# EasyEDA schematic SCH_Atmega328-Dev_Board v0.1_2022-11-11.json
TITLE: Sheet_1; REV: 1.0; Date: 2022-08-23; Sheet: 1/1; Drawn By: Max Solo; Company: Your Company
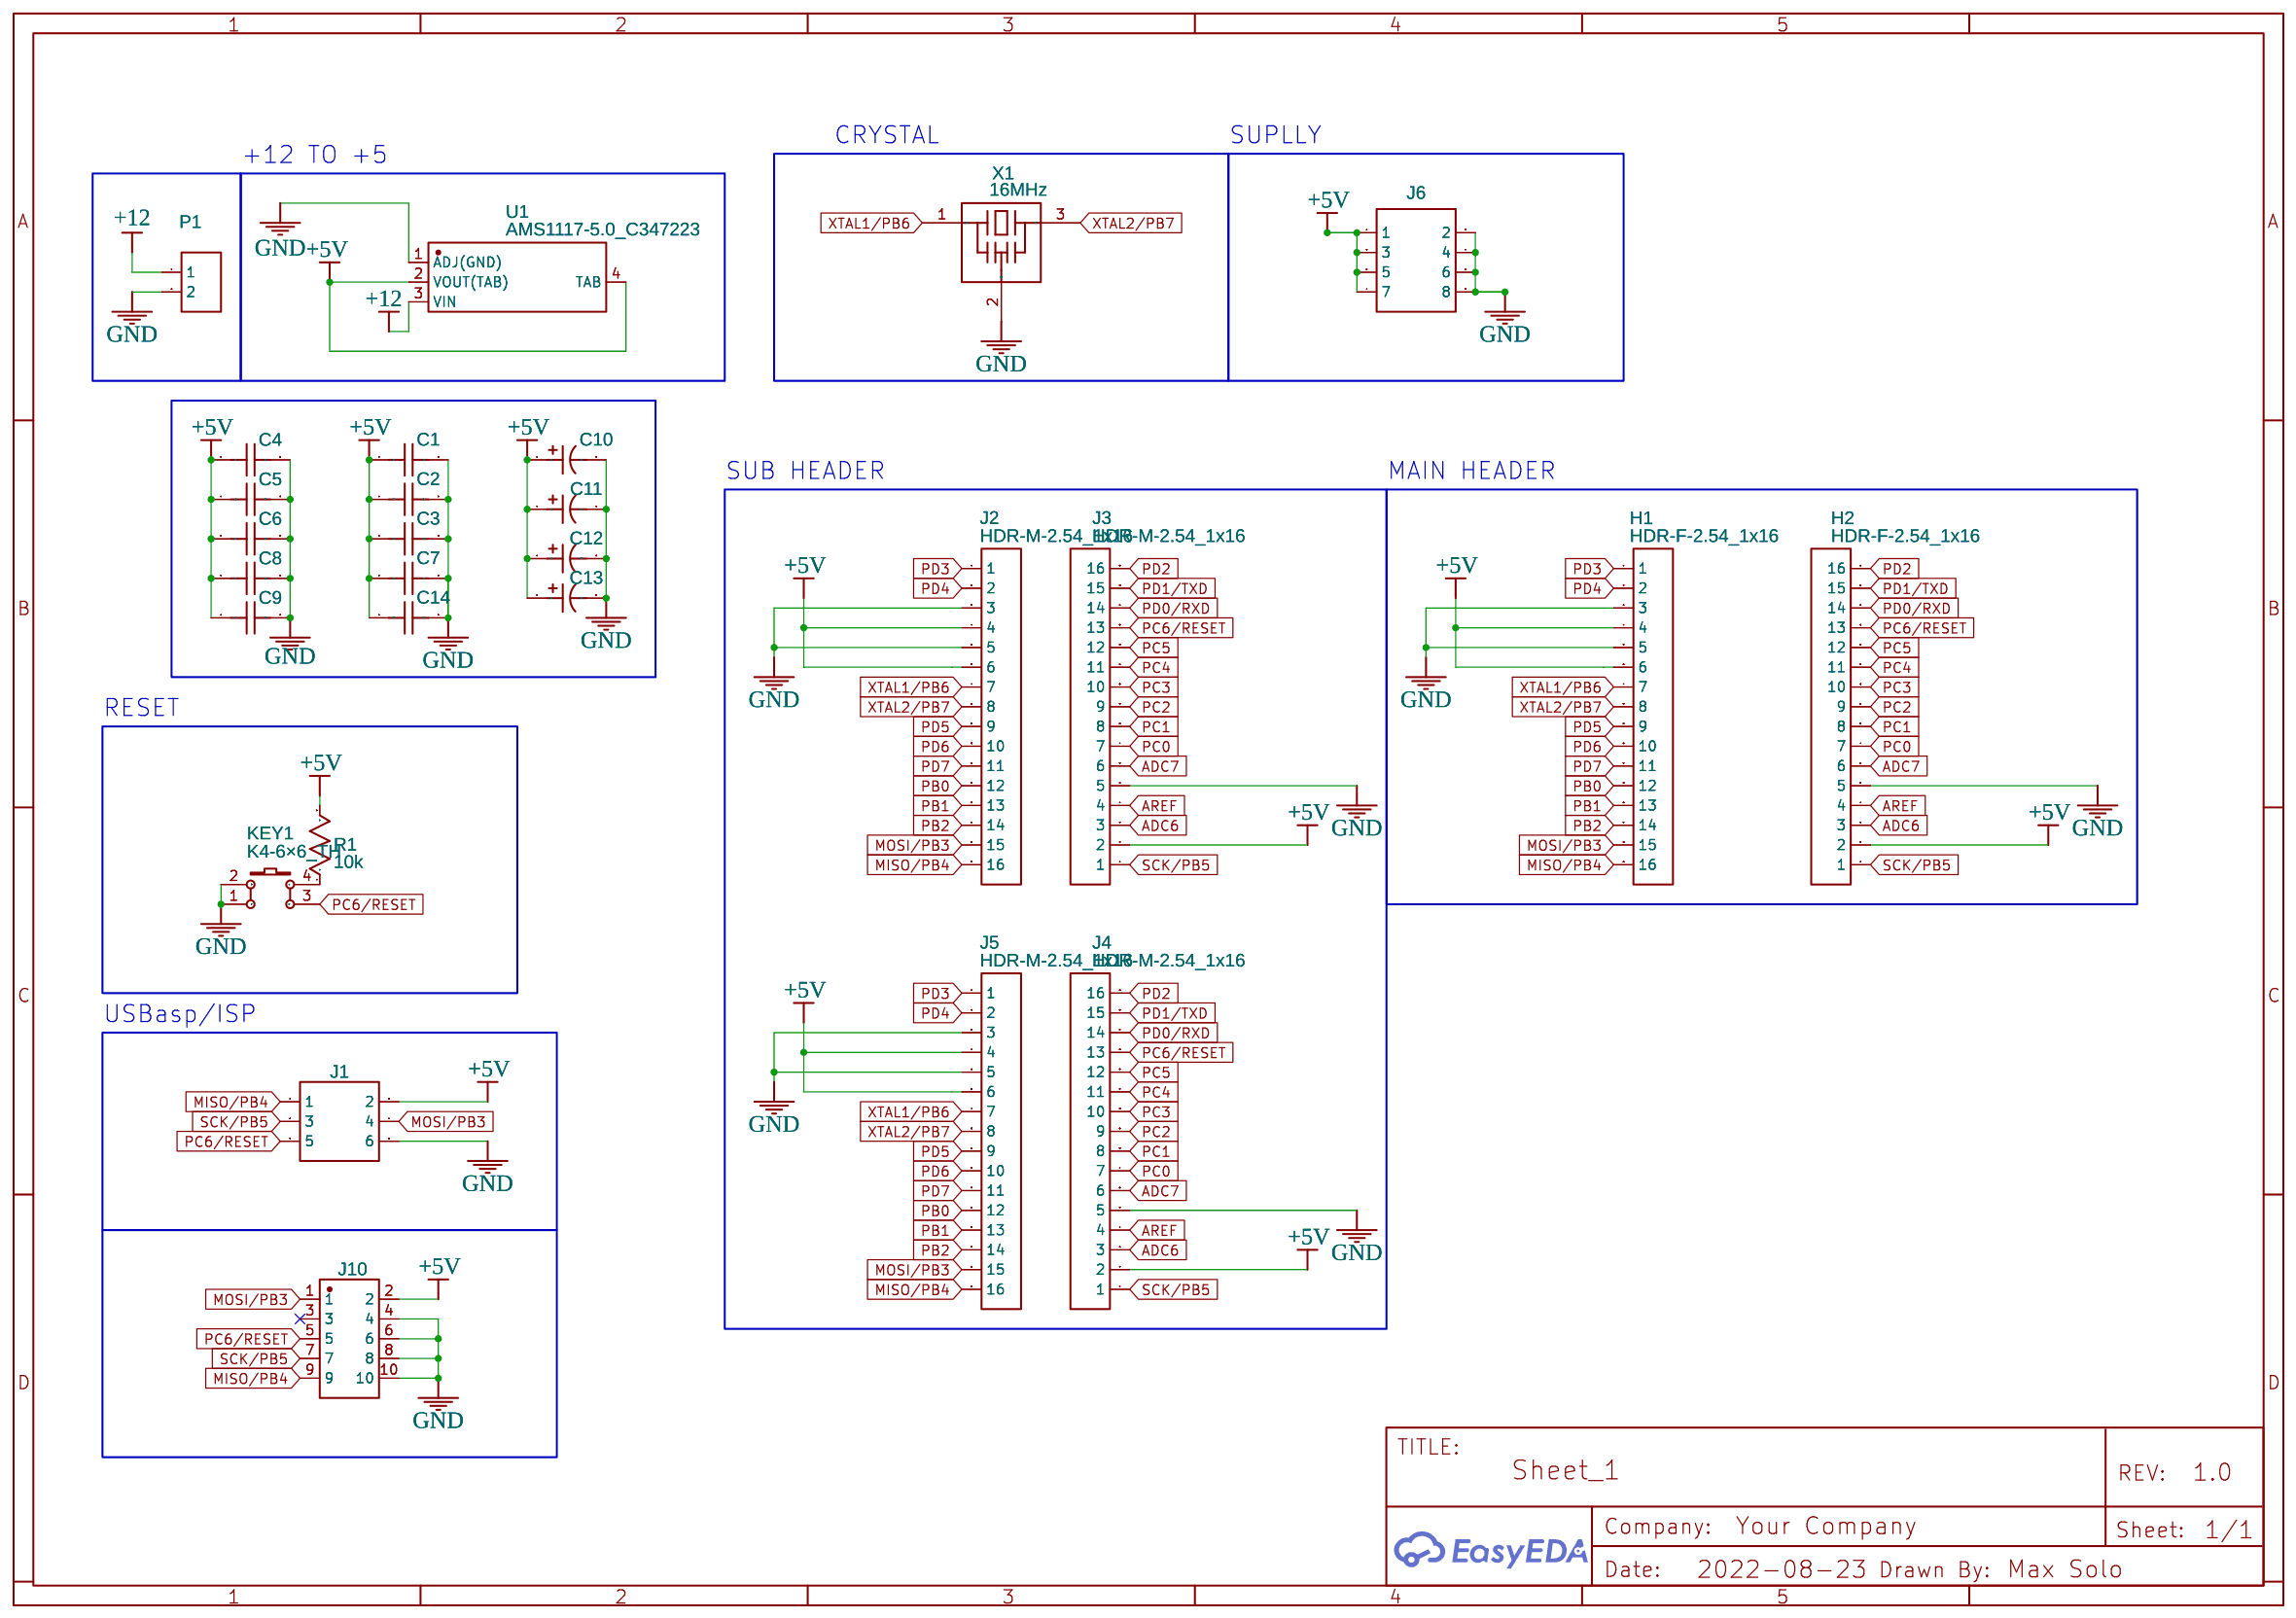
[diagram p0: schematic sheet]

## Parts
C1  200uF  [C0805]
C2  200uF  [C0805]
C3  200uF  [C0805]
C4  200uF  [C0805]
C5  200uF  [C0805]
C6  200uF  [C0805]
C7  0.1u  [C0805]
C8  200uF  [C0805]
C9  200uF  [C0805]
C10  330uF  [CAP-TH_BD6.3-P2.50-D1.0-FD]
C11  330uF  [CAP-TH_BD6.3-P2.50-D1.0-FD]
C12  330uF  [CAP-TH_BD6.3-P2.50-D1.0-FD]
C13  330uF  [CAP-TH_BD6.3-P2.50-D1.0-FD]
C14  0.1u  [C0805]
H1  HDR-F-2.54_1x16  [HDR-F-2.54_1X16]
H2  HDR-F-2.54_1x16  [HDR-F-2.54_1X16]
J1  HDR-M-2.54_2x3  [HDR-M-2.54_2X3]
J2  HDR-M-2.54_1x16  [HDR-M-2.54_1X16]
J3  HDR-M-2.54_1x16  [HDR-M-2.54_1X16]
J4  HDR-M-2.54_1x16  [HDR-M-2.54_1X16]
J5  HDR-M-2.54_1x16  [HDR-M-2.54_1X16]
J6  HDR-M-2.54_2x4  [HDR-M-2.54_2X4]
J10  X2530WV-2X05-PTSN  [CONN-TH_10P-P2.54_XKB0_X2530WV-2X05-PTSN]
KEY1  K4-6×6_TH  [KEY-TH_4P-L6.0-W6.0-P4.50-LS6.5]
P1  CONN-TH_2P-P5.00  [CONN-TH_2P-P5.00]
R1  10k  [R0805]
U1  AMS1117-5.0_C347223  [SOT-223_L6.7-W3.5-P2.30-BR]
X1  16MHz  [OSC-SMD_3P-L3.2-W1.3-P1.2-L]

## Library data of the parts
C1-C9 C14 = C_0805_US: Contributor: LCEDA_Lib
C10-C13 = SPT1AM331E07OR: Supplier: LCSC; Supplier Part: C697724; Manufacturer: Yunxing; Contributor: LCSC; JLCPCB Part Class: Extended Part
H1 H2 = HDR-F-2.54_1x16: Supplier Part: C66987; Supplier: LCSC; Contributor: LCEDA_Lib
J1 = HDR-M-2.54_2x3: Supplier Part: C65114; Supplier: LCSC; Contributor: LCEDA_Lib
J2-J5 = HDR-M-2.54_1x16: Supplier: LCSC; Contributor: LCEDA_Lib
J6 = HDR-M-2.54_2x4: Supplier Part: C58363; Supplier: LCSC; Contributor: LCEDA_Lib
J10 = X2530WV-2X05-PTSN: Supplier: LCSC; Supplier Part: C2882570; Manufacturer: XKB Connectivity(中国星坤); Manufacturer Part: X2530WV-2x05-PTSN; Contributor: LCSC; JLCPCB Part Class: Extended Part
KEY1 = K4-6×6_TH: Supplier: LCSC; Supplier Part: C136684; Manufacturer: 韩国韩荣; Manufacturer Part: K2-1102DP-E4SW-04; Contributor: LCEDA_Lib
P1 = CONN-TH_2P-P5.00: Supplier: LCSC; Contributor: LCEDA_Lib
R1 = R_0805_US: Contributor: LCEDA_Lib
U1 = AMS1117-5.0_C347223: Supplier: LCSC; Supplier Part: C347223; Manufacturer: Youtai Semiconductor Co., Ltd.; Manufacturer Part: AMS1117-5.0; Contributor: LCSC; JLCPCB Part Class: Extended Part
X1 = CSTCE16M0V13C99-R0: Supplier: LCSC; Manufacturer: MuRata; Supplier Part: C118038; JLCPCB Part Class: Extended Part

## Nets
+5V: C1.1 C2.1 C3.1 C4.1 C5.1 C6.1 C7.1 C8.1 C9.1 C10.1 C11.1 C12.1 C13.1 C14.1 H1.4 H1.6 H2.2 J1.2 J2.4 J2.6 J3.2 J4.2 J5.4 J5.6 J6.1 J6.3 J6.5 J6.7 J10.2 R1.2 U1.2(VOUT(TAB)) U1.4(TAB)
GND: C1.2 C2.2 C3.2 C4.2 C5.2 C6.2 C7.2 C8.2 C9.2 C10.2 C11.2 C12.2 C13.2 C14.2 H1.3 H1.5 H2.5 J1.6 J2.3 J2.5 J3.5 J4.5 J5.3 J5.5 J6.2 J6.4 J6.6 J6.8 J10.4 J10.6 J10.8 J10.10 KEY1.1 KEY1.2 P1.2 U1.1(ADJ(GND)) X1.2(VSS)
+12: P1.1 U1.3(VIN)
ADC6: H2.3 J3.3 J4.3
ADC7: H2.6 J3.6 J4.6
AREF: H2.4 J3.4 J4.4
MISO/PB4: H1.16 J1.1 J2.16 J5.16 J10.9
MOSI/PB3: H1.15 J1.4 J2.15 J5.15 J10.1
PB0: H1.12 J2.12 J5.12
PB1: H1.13 J2.13 J5.13
PB2: H1.14 J2.14 J5.14
PC0: H2.7 J3.7 J4.7
PC1: H2.8 J3.8 J4.8
PC2: H2.9 J3.9 J4.9
PC3: H2.10 J3.10 J4.10
PC4: H2.11 J3.11 J4.11
PC5: H2.12 J3.12 J4.12
PC6/RESET: H2.13 J1.5 J3.13 J4.13 J10.5 KEY1.3
PD0/RXD: H2.14 J3.14 J4.14
PD1/TXD: H2.15 J3.15 J4.15
PD2: H2.16 J3.16 J4.16
PD3: H1.1 J2.1 J5.1
PD4: H1.2 J2.2 J5.2
PD5: H1.9 J2.9 J5.9
PD6: H1.10 J2.10 J5.10
PD7: H1.11 J2.11 J5.11
SCK/PB5: H2.1 J1.3 J3.1 J4.1 J10.7
XTAL1/PB6: H1.7 J2.7 J5.7 X1.1
XTAL2/PB7: H1.8 J2.8 J5.8 X1.3
Net-(KEY1-4): KEY1.4 R1.1

Not connected (* = marked no-connect by the designer): J10 3*

## Notes on the sheet
- CRYSTAL
- SUPLLY
- +12 TO +5
- SUB HEADER
- MAIN HEADER
- RESET
- USBasp/ISP
